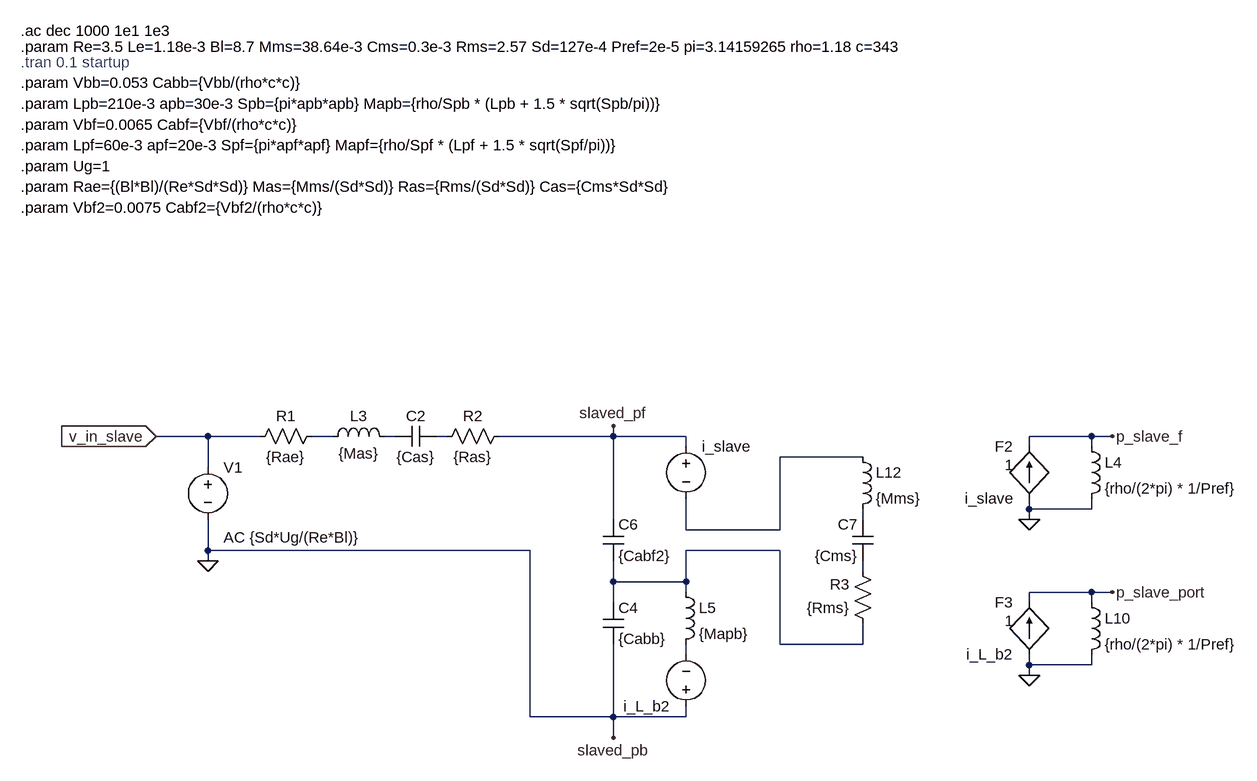
[diagram p0: schematic sim_6th_order - Kopi.asc]
sim_6th_order - Kopi.asc, the LTspice schematic file:
Version 4
SHEET 1 2536 1124
WIRE 112 -224 32 -224
WIRE 192 -224 112 -224
WIRE 304 -224 272 -224
WIRE 400 -224 384 -224
WIRE 480 -224 464 -224
WIRE 736 -224 736 -240
WIRE 736 -224 560 -224
WIRE 848 -224 736 -224
WIRE 1472 -224 1376 -224
WIRE 1504 -224 1472 -224
WIRE 848 -208 848 -224
WIRE 1376 -208 1376 -224
WIRE 1472 -208 1472 -224
WIRE 1120 -192 992 -192
WIRE 112 -176 112 -224
WIRE 1376 -112 1376 -128
WIRE 1472 -112 1472 -128
WIRE 1472 -112 1376 -112
WIRE 736 -96 736 -224
WIRE 1120 -96 1120 -112
WIRE 1376 -96 1376 -112
WIRE 848 -80 848 -128
WIRE 992 -80 992 -192
WIRE 992 -80 848 -80
WIRE 112 -48 112 -96
WIRE 608 -48 112 -48
WIRE 992 -48 848 -48
WIRE 112 -32 112 -48
WIRE 1120 -16 1120 -32
WIRE 736 0 736 -32
WIRE 848 0 848 -48
WIRE 848 0 736 0
WIRE 848 16 848 0
WIRE 1472 16 1376 16
WIRE 1504 16 1472 16
WIRE 736 32 736 0
WIRE 1376 32 1376 16
WIRE 1472 32 1472 16
WIRE 992 96 992 -48
WIRE 1120 96 1120 64
WIRE 1120 96 992 96
WIRE 848 112 848 96
WIRE 1376 128 1376 112
WIRE 1472 128 1472 112
WIRE 1472 128 1376 128
WIRE 1376 144 1376 128
WIRE 608 208 608 -48
WIRE 736 208 736 96
WIRE 736 208 608 208
WIRE 848 208 848 192
WIRE 848 208 736 208
WIRE 736 240 736 208
FLAG 112 -32 0
FLAG 1376 -96 0
FLAG 736 -240 slaved_pf
FLAG 736 240 slaved_pb
FLAG 32 -224 v_in_slave
IOPIN 32 -224 In
FLAG 1504 -224 p_slave_f
FLAG 1376 144 0
FLAG 1504 16 p_slave_port
SYMBOL voltage 112 -192 R0
WINDOW 3 24 152 Invisible 2
WINDOW 123 24 124 Left 2
WINDOW 39 0 0 Left 0
SYMATTR Value 1
SYMATTR Value2 AC {Sd*Ug/(Re*Bl)}
SYMATTR InstName V1
SYMBOL res 288 -240 R90
WINDOW 0 0 56 VBottom 2
WINDOW 3 32 56 VTop 2
SYMATTR InstName R1
SYMATTR Value {Rae}
SYMBOL ind 288 -208 R270
WINDOW 0 32 56 VTop 2
WINDOW 3 5 56 VBottom 2
SYMATTR InstName L3
SYMATTR Value {Mas}
SYMBOL cap 464 -240 R90
WINDOW 0 0 32 VBottom 2
WINDOW 3 32 32 VTop 2
SYMATTR InstName C2
SYMATTR Value {Cas}
SYMBOL res 576 -240 R90
WINDOW 0 0 56 VBottom 2
WINDOW 3 32 56 VTop 2
SYMATTR InstName R2
SYMATTR Value {Ras}
SYMBOL ind 1456 -224 R0
SYMATTR InstName L4
SYMATTR Value {rho/(2*pi) * 1/Pref}
SYMBOL f 1376 -128 R180
WINDOW 0 24 80 Left 2
WINDOW 3 24 0 Left 2
WINDOW 123 24 52 Left 2
SYMATTR InstName F2
SYMATTR Value i_slave
SYMATTR Value2 1
SYMBOL cap 720 32 R0
SYMATTR InstName C4
SYMATTR Value {Cabb}
SYMBOL ind 832 0 R0
SYMATTR InstName L5
SYMATTR Value {Mapb}
SYMBOL ind 1456 16 R0
SYMATTR InstName L10
SYMATTR Value {rho/(2*pi) * 1/Pref}
SYMBOL f 1376 112 R180
WINDOW 0 24 80 Left 2
WINDOW 3 24 0 Left 2
WINDOW 123 24 52 Left 2
SYMATTR InstName F3
SYMATTR Value i_L_b2
SYMATTR Value2 1
SYMBOL voltage 848 208 R180
WINDOW 123 0 0 Left 0
WINDOW 39 0 0 Left 0
SYMATTR InstName i_L_b2
SYMATTR Value ""
SYMBOL cap 720 -96 R0
SYMATTR InstName C6
SYMATTR Value {Cabf2}
SYMBOL voltage 848 -224 R0
WINDOW 123 0 0 Left 0
WINDOW 39 0 0 Left 0
SYMATTR InstName i_slave
SYMATTR Value ""
SYMBOL ind 1104 -208 R0
SYMATTR InstName L12
SYMATTR Value {Mms}
SYMBOL cap 1136 -32 R180
WINDOW 0 24 56 Left 2
WINDOW 3 24 8 Left 2
SYMATTR InstName C7
SYMATTR Value {Cms}
SYMBOL res 1136 80 R180
WINDOW 0 36 76 Left 2
WINDOW 3 36 40 Left 2
SYMATTR InstName R3
SYMATTR Value {Rms}
TEXT -176 -848 Left 2 !.ac dec 1000 1e1 1e3
TEXT -176 -824 Left 2 !.param Re=3.5 Le=1.18e-3 Bl=8.7 Mms=38.64e-3 Cms=0.3e-3 Rms=2.57 Sd=127e-4 Pref=2e-5 pi=3.14159265 rho=1.18 c=343
TEXT -176 -800 Left 2 ;.tran 0.1 startup
TEXT -176 -768 Left 2 !.param Vbb=0.053 Cabb={Vbb/(rho*c*c)}
TEXT -176 -736 Left 2 !.param Lpb=210e-3 apb=30e-3 Spb={pi*apb*apb} Mapb={rho/Spb * (Lpb + 1.5 * sqrt(Spb/pi))}
TEXT -176 -704 Left 2 !.param Vbf=0.0065 Cabf={Vbf/(rho*c*c)}
TEXT -176 -672 Left 2 !.param Lpf=60e-3 apf=20e-3 Spf={pi*apf*apf} Mapf={rho/Spf * (Lpf + 1.5 * sqrt(Spf/pi))}
TEXT -176 -576 Left 2 !.param Vbf2=0.0075 Cabf2={Vbf2/(rho*c*c)}
TEXT -176 -640 Left 2 !.param Ug=1
TEXT -176 -608 Left 2 !.param Rae={(Bl*Bl)/(Re*Sd*Sd)} Mas={Mms/(Sd*Sd)} Ras={Rms/(Sd*Sd)} Cas={Cms*Sd*Sd}

The netlist it stands for:
* sim_6th_order - Kopi.asc
V1 v_in_slave 0 1 AC {Sd*Ug/(Re*Bl)}
R1 N001 v_in_slave {Rae}
L3 N001 N002 {Mas}
C2 N003 N002 {Cas}
R2 slaved_pf N003 {Ras}
L4 p_slave_f 0 {rho/(2*pi) * 1/Pref}
F2 0 p_slave_f i_slave 1
C4 N006 0 {Cabb}
L5 N006 N008 {Mapb}
L10 p_slave_port 0 {rho/(2*pi) * 1/Pref}
F3 0 p_slave_port i_L_b2 1
V§i_L_b2 0 N008
C6 slaved_pf N006 {Cabf2}
V§i_slave slaved_pf N004
L12 N004 N005 {Mms}
C7 N007 N005 {Cms}
R3 N006 N007 {Rms}
.ac dec 1000 1e1 1e3
.param Re=3.5 Le=1.18e-3 Bl=8.7 Mms=38.64e-3 Cms=0.3e-3 Rms=2.57 Sd=127e-4 Pref=2e-5 pi=3.14159265 rho=1.18 c=343
* .tran 0.1 startup
.param Vbb=0.053 Cabb={Vbb/(rho*c*c)}
.param Lpb=210e-3 apb=30e-3 Spb={pi*apb*apb} Mapb={rho/Spb * (Lpb + 1.5 * sqrt(Spb/pi))}
.param Vbf=0.0065 Cabf={Vbf/(rho*c*c)}
.param Lpf=60e-3 apf=20e-3 Spf={pi*apf*apf} Mapf={rho/Spf * (Lpf + 1.5 * sqrt(Spf/pi))}
.param Vbf2=0.0075 Cabf2={Vbf2/(rho*c*c)}
.param Ug=1
.param Rae={(Bl*Bl)/(Re*Sd*Sd)} Mas={Mms/(Sd*Sd)} Ras={Rms/(Sd*Sd)} Cas={Cms*Sd*Sd}
.backanno
.end